# EAGLE design ESP8266-01 (EAGLE 9.4.1)
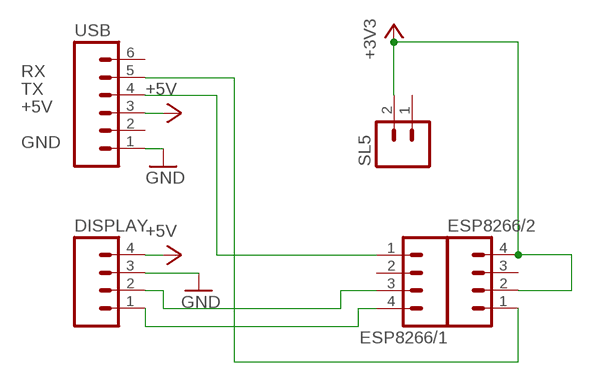
[diagram p0: schematic, sheet 1]

## Parts
DISPLAY  M04  [04P]
ESP8266/1  M04  [04P]
ESP8266/2  M04  [04P]
SL5  M02  [02P]
USB  M06  [06P]

## Nets
+3V3: ESP8266/2.2 ESP8266/2.4 SL5.2
+5V: DISPLAY.4 USB.3
GND: DISPLAY.3 USB.1
N$1: DISPLAY.2 ESP8266/1.3
N$2: DISPLAY.1 ESP8266/1.4
RX: ESP8266/2.1 USB.5
TX: ESP8266/1.1 USB.4
Unconnected: ESP8266/1.2 ESP8266/2.3 SL5.1 USB.2 USB.6

## Library data of the parts
DISPLAY ESP8266/1 ESP8266/2 = con-amp-quick:M04: AMP QUICK CONNECTOR; OC_FARNELL: unknown; OC_NEWARK: unknown
SL5 = con-amp-quick:M02: AMP QUICK CONNECTOR; OC_FARNELL: unknown; OC_NEWARK: unknown
USB = con-amp-quick:M06: AMP QUICK CONNECTOR; OC_FARNELL: unknown; OC_NEWARK: unknown

## Board
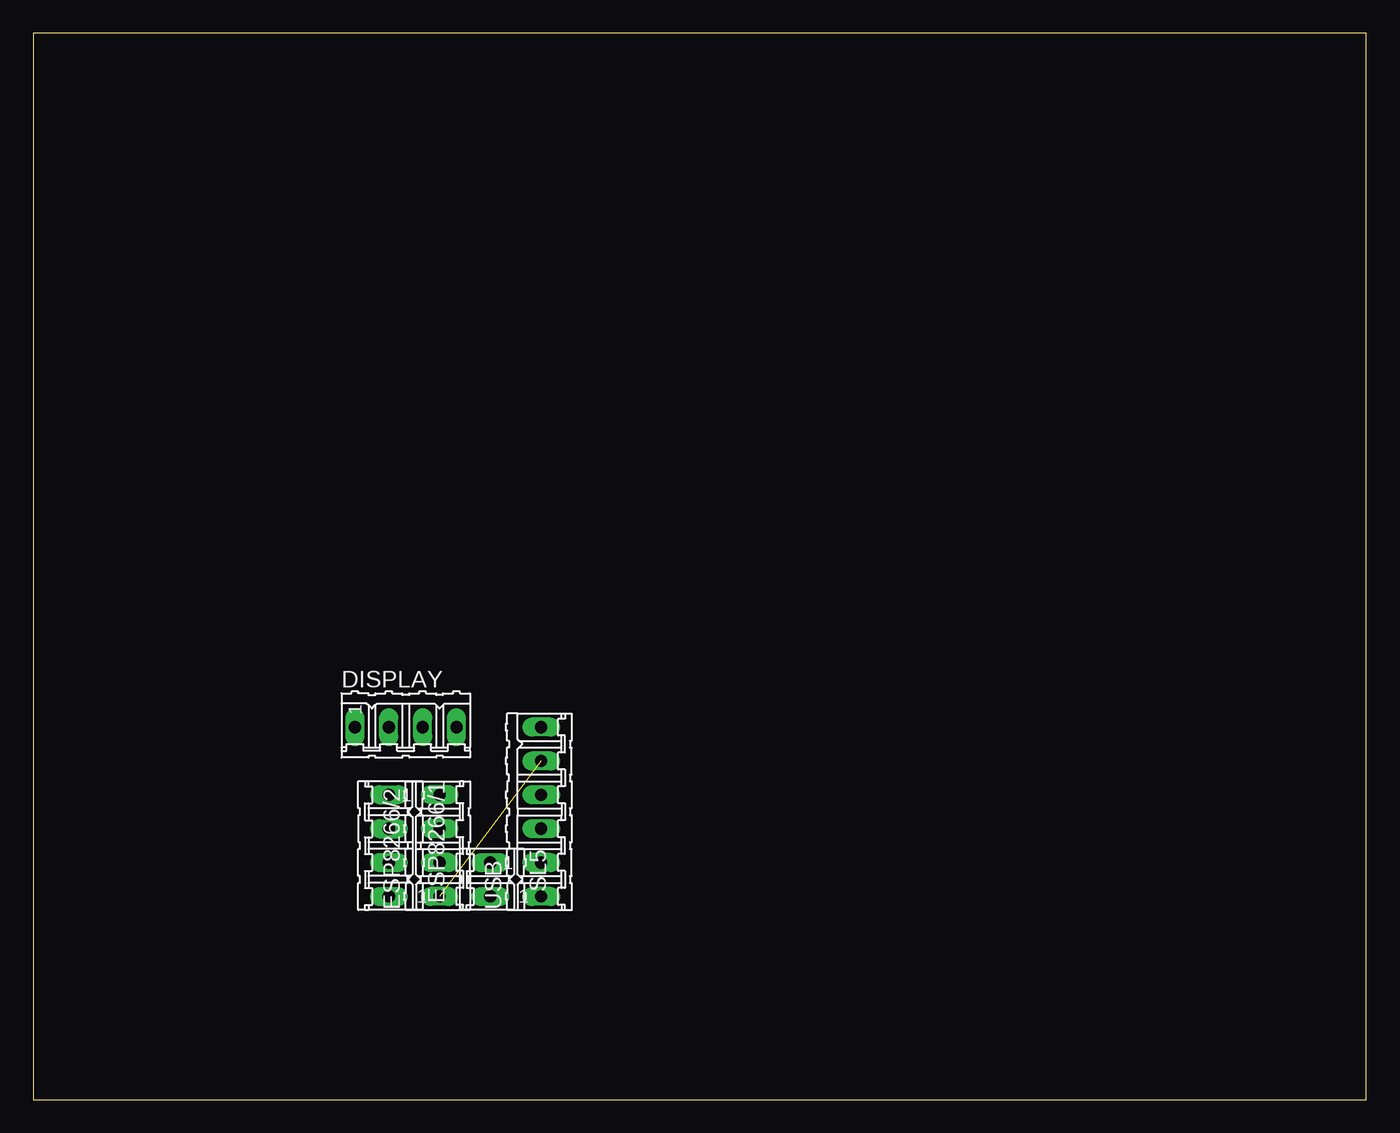
[diagram p1: board, top side]
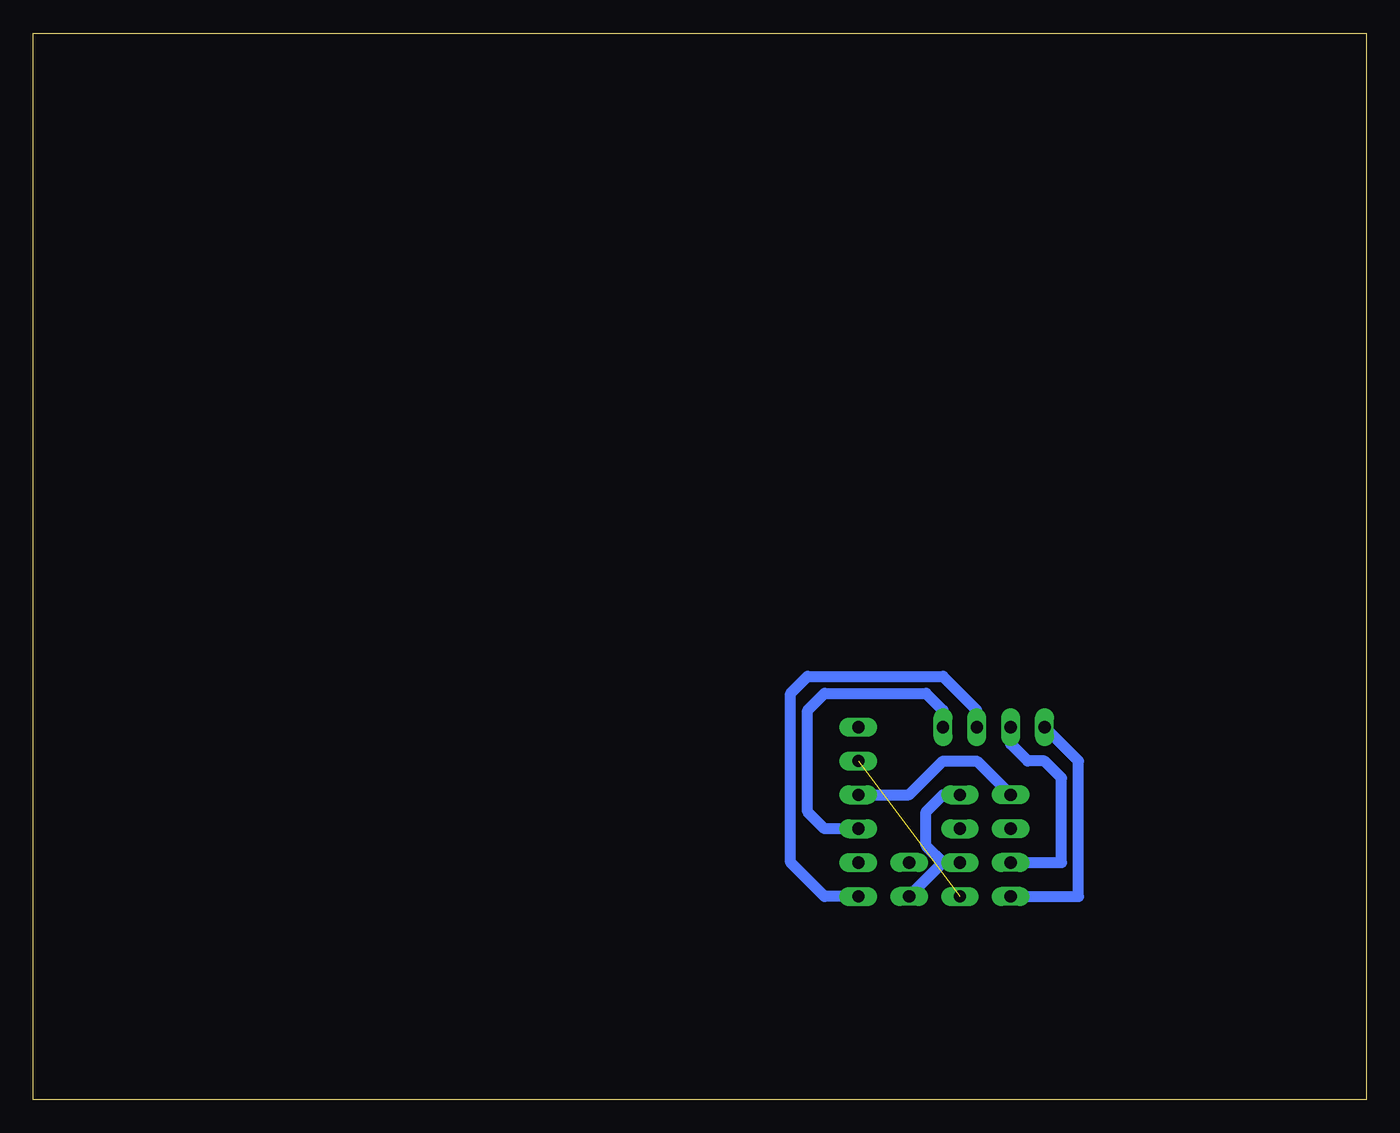
[diagram p2: board, bottom side, seen from below]

Size 100 x 80 mm. Coordinates in mm from the lower left corner, seen from the top.
Outline: 0,0 100,0 100,80 0,80 0,0
Copper layers (1*16): Top 0.035mm / dielectric 1.5mm / Bottom 0.035mm
Design rules "default": minimum track width 6mil, minimum drill 0.35mm, track to track 6mil, track to pad 6mil, pad to pad 6mil, via to via 6mil, smd to smd 6mil, copper to edge 40mil, drill to drill 6mil, minimum pad ring 10mil, minimum via ring 8mil, stop-mask expansion 4mil, vias tented up to drill 0mil, thermal gap 10mil

### Footprints (pad centres in the part's own frame; a part is rotated, then mirrored left to right if it is on the bottom)
04P = drill 0.914 long: 1 -3.81,0; 2 -1.27,0; 3 1.27,0; 4 3.81,0
02P = drill 0.914 long: 1 -1.27,0; 2 1.27,0
06P = drill 0.914 long: 1 -6.35,0; 2 -3.81,0; 3 -1.27,0; 4 1.27,0; 5 3.81,0; 6 6.35,0

### Placement (x,y rotation side)
DISPLAY  27.94,27.94 0 top
ESP8266/1  26.67,19.05 270 top
ESP8266/2  30.48,19.05 90 top
SL5  34.29,16.51 270 top
USB  38.1,21.59 90 top

### Tracks (layer width: path | path; a pad name or v marks a point on that pad's centre or on a via)
+3V3
  Bottom 0.813: ESP8266/2.4 31.75,22.86 33.02,21.59 33.02,19.05 31.75,17.78 | SL5.2 31.75,17.78 | 31.75,17.78 ESP8266/2.2
+5V
  Bottom 0.813: USB.3 40.64,20.32 41.91,21.59 41.91,29.21 40.64,30.48 33.02,30.48 31.75,29.21 DISPLAY.4
GND
  Bottom 0.813: USB.1 40.64,15.24 43.18,17.78 43.18,30.48 41.91,31.75 31.75,31.75 29.21,29.21 DISPLAY.3
N$1
  Bottom 0.813: ESP8266/1.3 22.86,17.78 22.86,24.13 24.13,25.4 25.4,25.4 26.67,26.67 DISPLAY.2
N$2
  Bottom 0.813: ESP8266/1.4 21.59,15.24 21.59,25.4 DISPLAY.1
RX  (1 unrouted)
TX
  Bottom 0.813: USB.4 34.29,22.86 31.75,25.4 29.21,25.4 ESP8266/1.1